# EAGLE design usbdacpcm2704_1_1 (EAGLE 5.11)
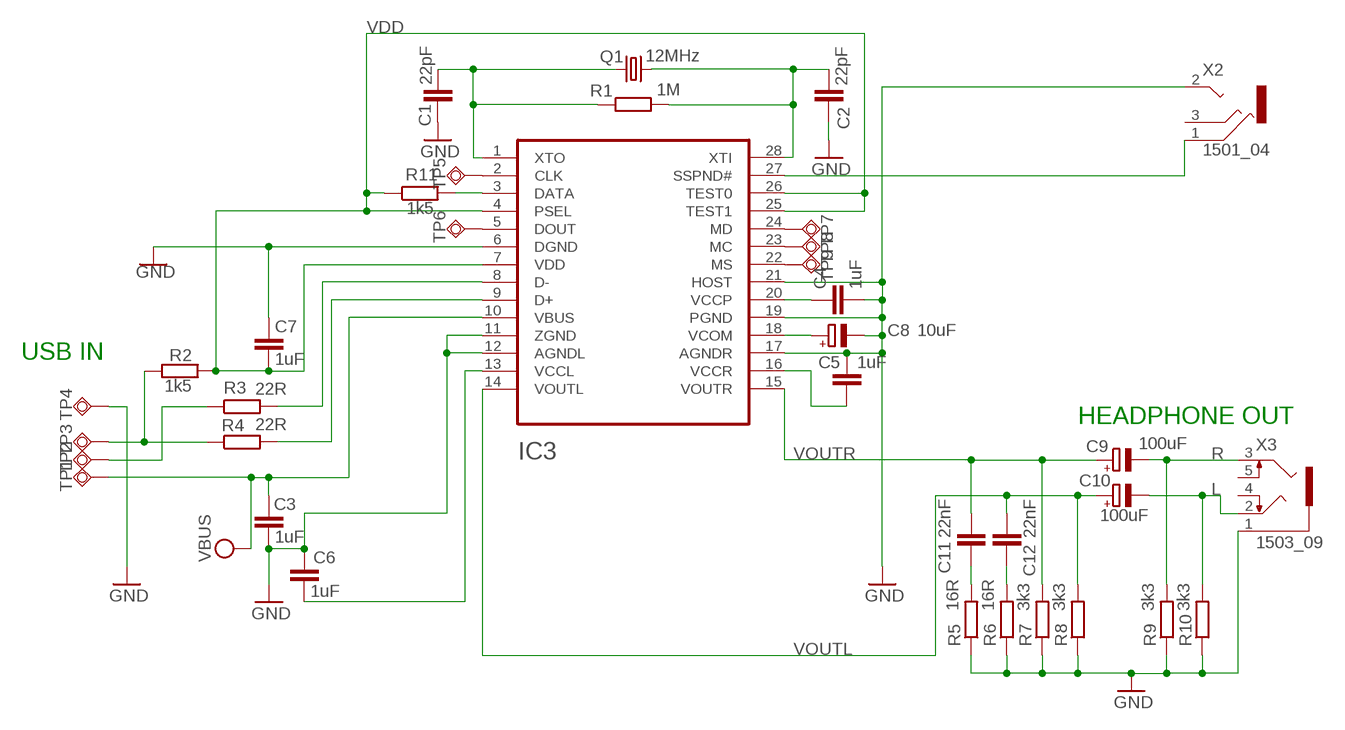
[diagram p0: schematic, sheet 1]

## Parts
C1  22pF  C-EUC0805  [C0805]
C2  22pF  C-EUC0805  [C0805]
C3  1uF  C-EUC0805  [C0805]
C4  1uF  C-EUC1206  [C1206]
C5  1uF  C-EUC0805  [C0805]
C6  1uF  C-EUC0805  [C0805]
C7  1uF  C-EUC0805  [C0805]
C8  10uF  CPOL-EUB/3528-21R  [B/3528-21R]
C9  100uF  CPOL-EUB/3528-21R  [B/3528-21R]
C10  100uF  CPOL-EUB/3528-21R  [B/3528-21R]
C11  22nF  C-EUC0805  [C0805]
C12  22nF  C-EUC0805  [C0805]
IC3  PCM2705  [SSOP28]
Q1  12MHz  CRYSTALHC49U-V  [HC49U-V]
R1  1M  R-EU_R0805  [R0805]
R2  1k5  R-EU_R1206  [R1206]
R3  22R  R-EU_R0805  [R0805]
R4  22R  R-EU_R0805  [R0805]
R5  16R  R-EU_R0805  [R0805]
R6  16R  R-EU_R0805  [R0805]
R7  3k3  R-EU_R0805  [R0805]
R8  3k3  R-EU_R0805  [R0805]
R9  3k3  R-EU_R0805  [R0805]
R10  3k3  R-EU_R0805  [R0805]
R11  1k5  R-EU_R0805  [R0805]
TP1  TPSQTP12SQ  [TP12SQ]
TP2  TPSQTP12SQ  [TP12SQ]
TP3  TPSQTP12SQ  [TP12SQ]
TP4  TPSQTP12SQ  [TP12SQ]
TP5  TPSQTP12SQ  [TP12SQ]
TP6  TPSQTP12SQ  [TP12SQ]
TP7  TPSQTP12SQ  [TP12SQ]
TP8  TPSQTP12SQ  [TP12SQ]
TP9  TPSQTP12SQ  [TP12SQ]
X2  1501_04  [1501_05]
X3  1503_09  [1503_09]

## Nets
DATA: IC3.3(DATA) R11.2
GND: C1.2 C2.2 C3.2 C4.2 C5.2 C6.1 C7.1 C8.- IC3.6(DGND) IC3.11(ZGND) IC3.12(AGNDL) IC3.17(AGNDR) IC3.19(PGND) IC3.21(HOST) R5.1 R6.1 R7.1 R8.1 R9.1 R10.1 TP4.TP X2.2 X3.1
L: C10.- R10.2 X3.2
N$1: IC3.8(D-) R3.2
N$2: IC3.9(D+) R4.2
N$3: R3.1 TP2.TP
N$4: C6.2 IC3.13(VCCL)
N$5: R2.1 R4.1 TP3.TP
N$6: IC3.2(CLK) TP5.TP
N$7: IC3.5(DOUT) TP6.TP
N$8: IC3.24(MD) TP7.TP
N$9: IC3.23(MC) TP8.TP
N$10: IC3.22(MS) TP9.TP
N$26: C11.2 R5.2
N$27: C12.2 R6.2
R: C9.- R9.2 X3.3
SUSPEND: IC3.27(SSPND#) X2.1
VBUS: C3.1 IC3.10(VBUS) TP1.TP
VCCR: C5.1 IC3.16(VCCR)
VCOM: C8.+ IC3.18(VCOM)
VCPP: C4.1 IC3.20(VCCP)
VDD: C7.2 IC3.4(PSEL) IC3.7(VDD) IC3.25(TEST1) IC3.26(TEST0) R2.2 R11.1
VOUTL: C10.+ C12.1 IC3.14(VOUTL) R8.2
VOUTR: C9.+ C11.1 IC3.15(VOUTR) R7.2
XTI: C2.1 IC3.28(XTI) Q1.2 R1.2
XTO: C1.1 IC3.1(XTO) Q1.1 R1.1
Unconnected: X2.3 X3.4 X3.5

## Notes on the sheet
- USB IN
- HEADPHONE OUT

## Library data of the parts
C1-C7 C11 C12 = rcl:C-EU: CAPACITOR, European symbol
C8-C10 = rcl:CPOL-EU: POLARIZED CAPACITOR, European symbol
IC3 = PCM2705:PCM2705
Q1 = crystal:CRYSTAL: CRYSTAL
R1-R11 = rcl:R-EU_: RESISTOR, European symbol
TP1-TP9 = testpad:TPSQ: Test pad
X2 = con-lumberg:1501_0*: Jack connectors according to JISC 6560, 2.5 mm Klinkensteckverbinder nach JISC 6560, 2,5 mm Source: http://www.lumberg.com/Produkte/PDFs/1501_05.pdfedit 1501_03 http://www.lumberg.com/Produkte/PDFs/1501_06.pdf; OC_FARNELL: 1216977; OC_NEWARK: unknown
X3 = con-lumberg:1503_09: Jack connectors according to JISC 6560, 3.5 mm Klinkeneinbaukupplung nach JISC 6560, 3,5 mm, 3-polig/ stereo, abgewinkelte Ausführung, mit 2 Öffnern und Lötaugen, für Leiterplatten Rückseitenmontage Source: http://www.lumberg.com/Produkte/PDFs/1503_09.pdf

## Board
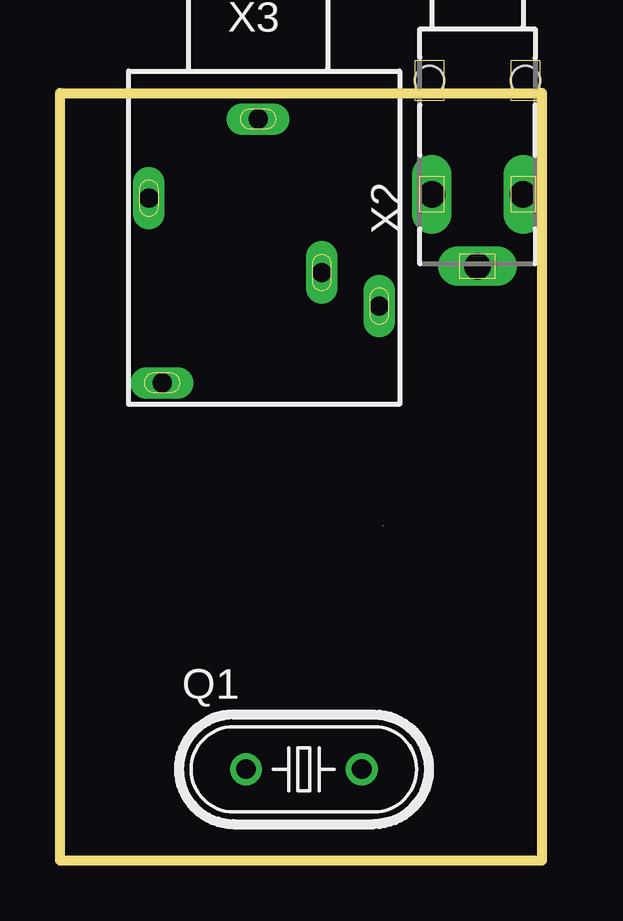
[diagram p1: board, top side]
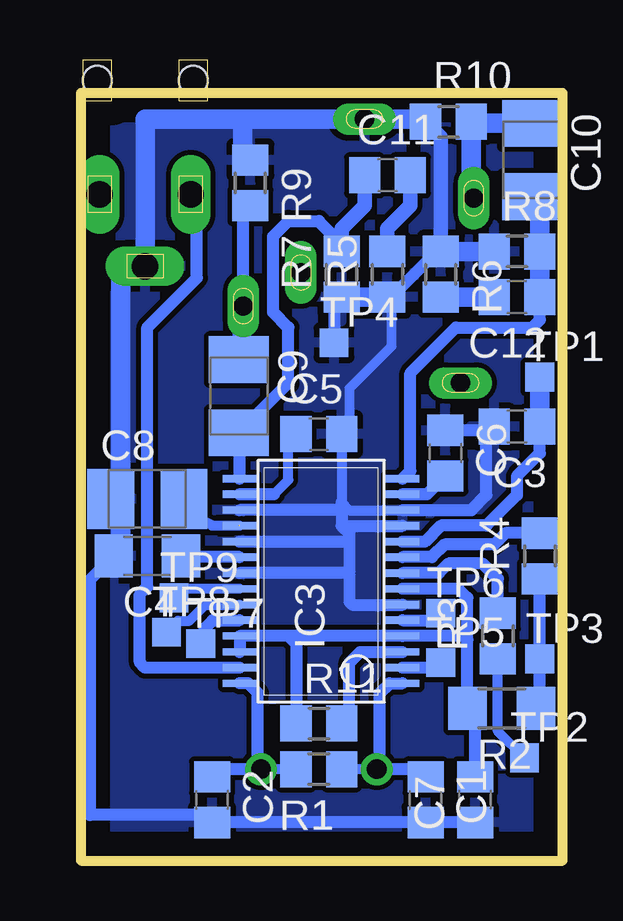
[diagram p2: board, bottom side, seen from below]

Size 20.08 x 32 mm. Coordinates in mm from the lower left corner, seen from the top.
Outline: 0,32 20.08,32 20.08,0 0,0 0,32
Copper layers (1*16): Top 0.035mm / dielectric 1.5mm / Bottom 0.035mm
Design rules "default": minimum track width 10mil, minimum drill 24mil, track to track 8mil, track to pad 8mil, pad to pad 8mil, via to via 8mil, smd to smd 8mil, copper to edge 40mil, drill to drill 8mil, minimum pad ring 10mil, minimum via ring 8mil, stop-mask expansion 4mil, vias tented up to drill 0mil, thermal gap 10mil

### Footprints (pad centres in the part's own frame; a part is rotated, then mirrored left to right if it is on the bottom)
C0805 = smd 1.3 x 1.5: 1 -0.95,0; 2 0.95,0
C1206 = smd 1.6 x 1.8: 1 -1.4,0; 2 1.4,0
B/3528-21R = smd 1.95 x 2.5: + 1.525,0; - -1.525,0
SSOP28 = smd 0.305 x 1.397: 1 -4.039,-2.856; 2 -3.384,-2.856; 3 -2.729,-2.856; 4 -2.063,-2.856; 5 -1.409,-2.856; 6 -0.763,-2.856; 7 -0.099,-2.856; 8 0.556,-2.856; 9 1.222,-2.856; 10 1.866,-2.856; 11 2.531,-2.856; 12 3.186,-2.856; 13 3.841,-2.856; 14 4.496,-2.856; 15 4.496,3.937; 16 3.841,3.937; 17 3.186,3.937; 18 2.531,3.937; 19 1.866,3.937; 20 1.222,3.937; 21 0.556,3.937; 22 -0.099,3.937; 23 -0.763,3.937; 24 -1.409,3.937; 25 -2.063,3.937; 26 -2.729,3.937; 27 -3.384,3.937; 28 -4.039,3.937
HC49U-V = drill 0.813 round: 1 -2.413,0; 2 2.413,0
R0805 = smd 1.3 x 1.5: 1 -0.95,0; 2 0.95,0
R1206 = smd 1.6 x 1.803: 1 -1.422,0; 2 1.422,0
TP12SQ = smd 1.2 x 1.2: TP 0,0
1501_05 = drill 1.1 pad 1.4 long: 1 -1.9,-8.5; 2 0,-11.5; 3 1.9,-8.5 | hole 1.2: -2,-3.75; 2,-3.75
1503_09 = drill 0.8 pad 1.2 long: 1 0,-2.1; 2 -4.55,-5.4; 3 5.05,-9.9; 4 -4,-13.1; 5 2.65,-8.5

### Placement (x,y rotation side)
C1  5.71,2.54 270 bottom
C2  14.61,2.54 270 bottom
C3  1.91,18.1 180 bottom
C4  17.3,12.7 180 bottom
C5  10.16,17.78 0 bottom
C6  4.89,16.99 270 bottom
C7  3.65,2.54 90 bottom
C8  17.3,15.08 0 bottom
C9  13.49,19.37 270 bottom
C10  1.27,29.21 270 bottom
C11  7.3,28.57 0 bottom
C12  1.91,23.5 180 bottom
IC3  9.53,11.43 90 bottom
Q1  10.16,3.81 0 top
R1  10.16,3.81 180 bottom
R2  2.54,6.35 180 bottom
R3  2.7,9.37 90 bottom
R4  0.95,12.7 90 bottom
R5  7.3,24.45 90 bottom
R6  5.08,24.45 270 bottom
R7  9.21,24.45 90 bottom
R8  1.91,25.4 0 bottom
R9  13.02,28.26 270 bottom
R10  4.76,30.8 0 bottom
R11  10.16,5.72 0 bottom
TP1  0.95,20.16 0 bottom
TP2  1.59,4.29 0 bottom
TP3  0.95,8.41 0 bottom
TP4  9.53,21.59 0 bottom
TP5  5.08,8.26 0 bottom
TP6  5.08,10.32 0 bottom
TP7  15.08,9.05 0 bottom
TP8  16.51,9.53 0 bottom
TP9  16.19,10.95 0 bottom
X2  17.39,36.28 0 top
X3  8.26,33.02 0 top

### Tracks (layer width: path | path; a pad name or v marks a point on that pad's centre or on a via)
DATA
  Bottom 0.508: IC3.3 8.44,8.7 8.89,8.26 8.89,6.04 R11.2
GND
  Bottom 0.406: IC3.12 6.68,14.61 8.89,14.61 9.21,14.93 C5.2 8.89,18.1 8.89,19.68 7.14,21.43 7.14,23.5 | IC3.17 13.47,14.61
  Bottom 0.508: R5.1 7.14,23.5 5.56,25.08 5.39,25.08 R6.1 | 9.2,13.96 IC3.11 | 9.2,13.96 9.21,13.97 9.21,14.61 | 9.21,14.61 9.21,14.92 9.21,14.93 | 8.97,11.99 IC3.21 | 8.97,11.99 8.89,12.06 8.89,13.34 | 8.89,13.34 8.89,13.65 9.2,13.96 | IC3.17 9.22,14.62 9.21,14.61 | IC3.19 8.93,13.3 8.89,13.34 | IC3.6 8.76,10.67 8.89,10.79 8.89,11.91 8.97,11.99 | IC3.12 3.8,14.62 3.17,15.24 3.17,17.78 C3.2 3.01,17.94 C6.1 | C8.- 18.35,13.78 C4.2 19.68,11.72 19.68,1.91 14.92,1.91 C2.2 C1.2 C7.1 | TP4.TP 9.53,23.18 R7.1
  Bottom 0.61: R10.1 5.08,30.16 R6.1
  Bottom 0.813: R10.1 5.71,30.92 X3.1 13.34,30.92 | R8.1 R6.1 | R5.1 R7.1 | 13.34,30.92 17.39,30.92 X2.2 17.39,24.77 18.41,24.77 18.41,12.86 C4.2 | R9.1 13.34,29.21 13.34,30.92
  pour Bottom: 0,0 20,0 20,31.91 0,31.91
L
  Bottom 0.813: 3.71,28.2 X3.2 3.81,27.62 R10.2 3.75,30.73 C10.-
N$1
  Bottom 0.508: IC3.8 5.16,11.99 4.76,12.38 3.33,12.38 2.7,11.75 R3.2 | R3.2
N$2
  Bottom 0.508: IC3.9 5.45,12.65 4.92,13.18 2.86,13.18 2.38,13.65 R4.2
N$3
  Bottom 0.406: R3.1 2.7,5.4 TP2.TP
N$4
  Bottom 0.508: IC3.13 5.66,15.27 C6.2
N$5
  Bottom 0.508: R4.1 TP3.TP 0.95,6.52 R2.1
N$6
  Bottom 0.508: IC3.2 5.29,8.05 TP5.TP
N$7
  Bottom 0.508: IC3.5 5.38,10.02 TP6.TP
N$8
  Bottom 0.508: IC3.24 14.59,10.02 14.92,9.68 14.92,9.21 TP7.TP
N$9
  Bottom 0.406: IC3.23 14.89,10.67 15.56,10 16.03,10 TP8.TP
N$10
  Bottom 0.406: IC3.22 15.81,11.33 TP9.TP
N$26
  Bottom 0.61: C11.2 6.35,27.3 7.3,26.35 R5.2
N$27
  Bottom 0.813: C12.2 R6.2
R
  Bottom 0.508: C9.- 13.49,22.93 X3.3 13.3,27.02 R9.2
SUSPEND
  Bottom 0.508: X2.1 15.24,27.52 15.24,24.29 17.3,22.23 17.3,11.43 17.62,11.11 17.62,8.26 17.41,8.05 IC3.27
VBUS
  Bottom 0.508: IC3.10 5.75,13.3 5.08,13.97 3.17,13.97 1.91,15.24 1.91,16.03 0.95,16.99 C3.1
  Bottom 0.813: C3.1 TP1.TP
VCCR
  Bottom 0.406: 12.03,15.27 11.43,15.88 11.43,17.46 C5.1
  Bottom 0.508: 12.03,15.27 IC3.16
VCOM  (1 unrouted)
  Bottom 0.406: IC3.18 14.61,13.97 15.56,14.45 15.46,14.61
  Bottom 0.508: 15.46,14.38 15.46,14.61 C8.+
VCPP
  Bottom 0.508: IC3.20 15.19,12.65 15.24,12.7 15.88,12.57 C4.1
VDD
  Bottom 0.508: IC3.26 IC3.25 11.43,9.37 | IC3.4 11.43,9.37 | IC3.4 | R11.1 11.11,9.05 11.43,9.37 | C7.2 3.65,6.04 R2.2 3.97,9.21 | IC3.7 4.35,11.33 3.97,10.95 3.97,9.21 | IC3.4 4.13,9.37 3.97,9.21
VOUTL
  Bottom 0.508: C12.1 0.95,22.54 1.27,22.23 4.45,22.23 6.35,20.32 6.35,16.25 IC3.14
  Bottom 0.813: C12.1 R8.2 0.95,27.37 C10.+
VOUTR
  Bottom 0.508: IC3.15 13.46,17.81 C9.+ 11.43,19.91 11.43,22.23 12.06,22.86 12.06,26.04 11.43,26.67 10.16,26.67 9.21,25.72 R7.2
  Bottom 0.61: C11.1 8.26,27.3 9.21,26.35 R7.2
XTI
  Bottom 0.406: R1.2 Q1.2
  Bottom 0.508: IC3.28 13.11,7.39 12.7,6.99 12.7,3.94 Q1.2 14.29,3.81 C2.1
XTO
  Bottom 0.406: Q1.1 R1.1
  Bottom 0.508: IC3.1 7.21,7.39 7.62,6.99 7.62,3.94 Q1.1 6.04,3.81 C1.1